# EasyEDA Pro project 最小系统板.eprj, board PCB1
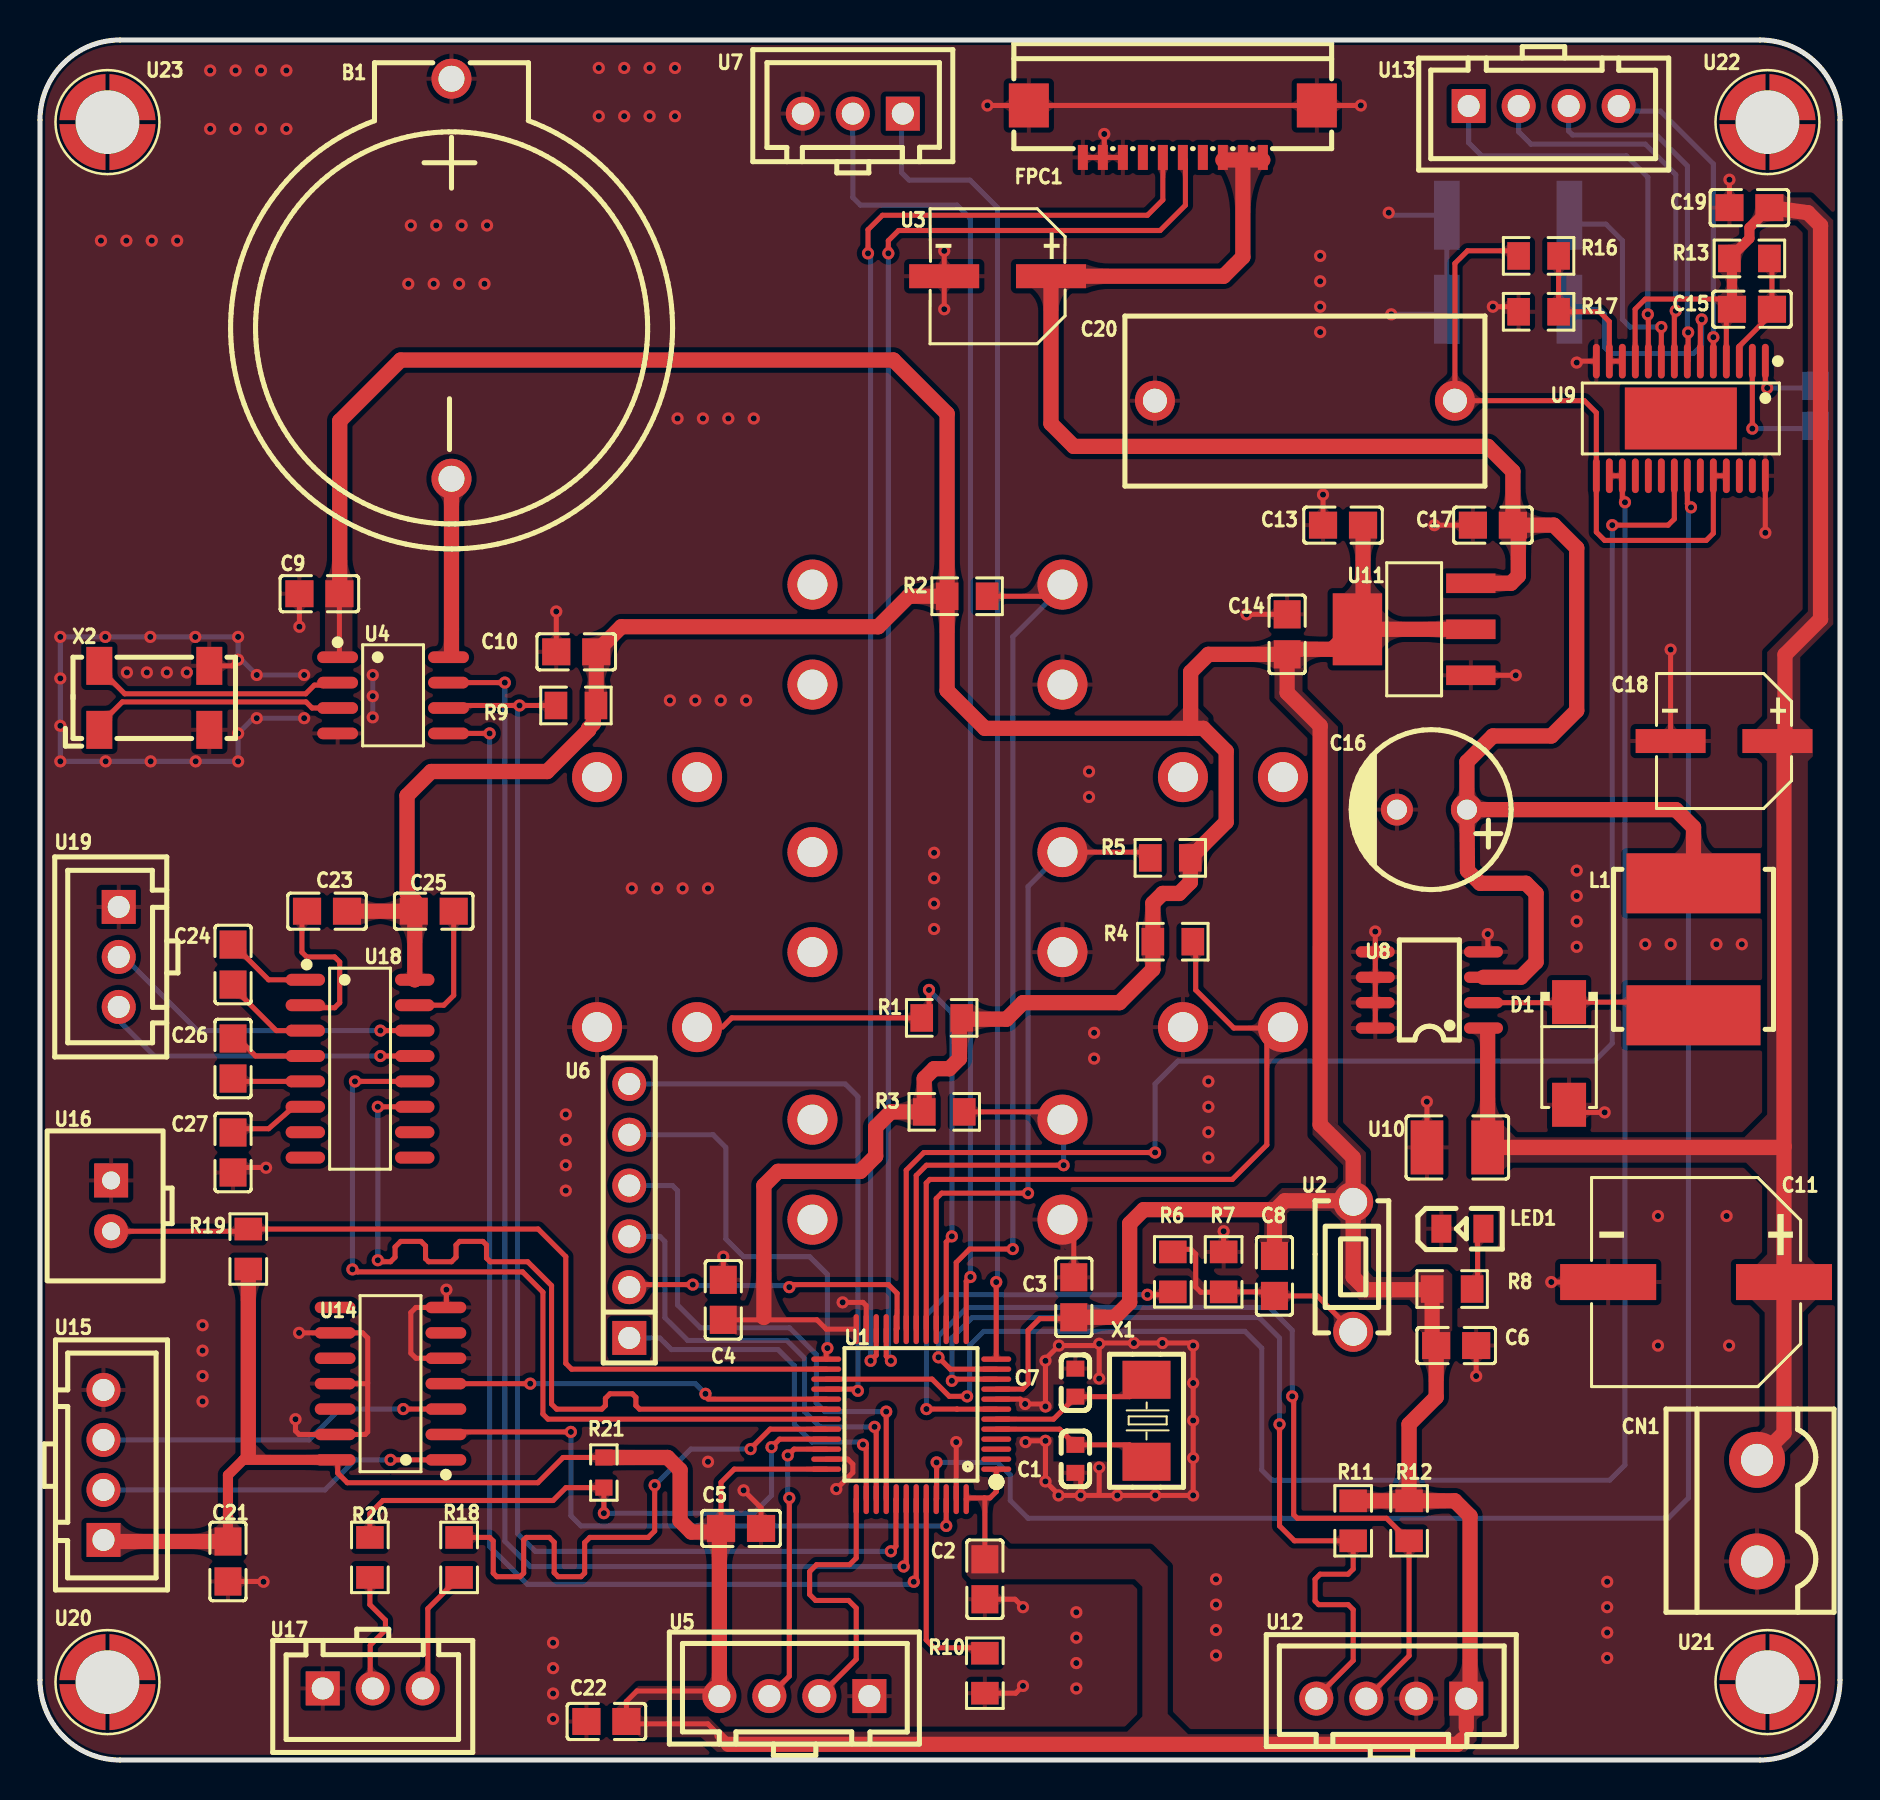
[diagram p1: board, top side]
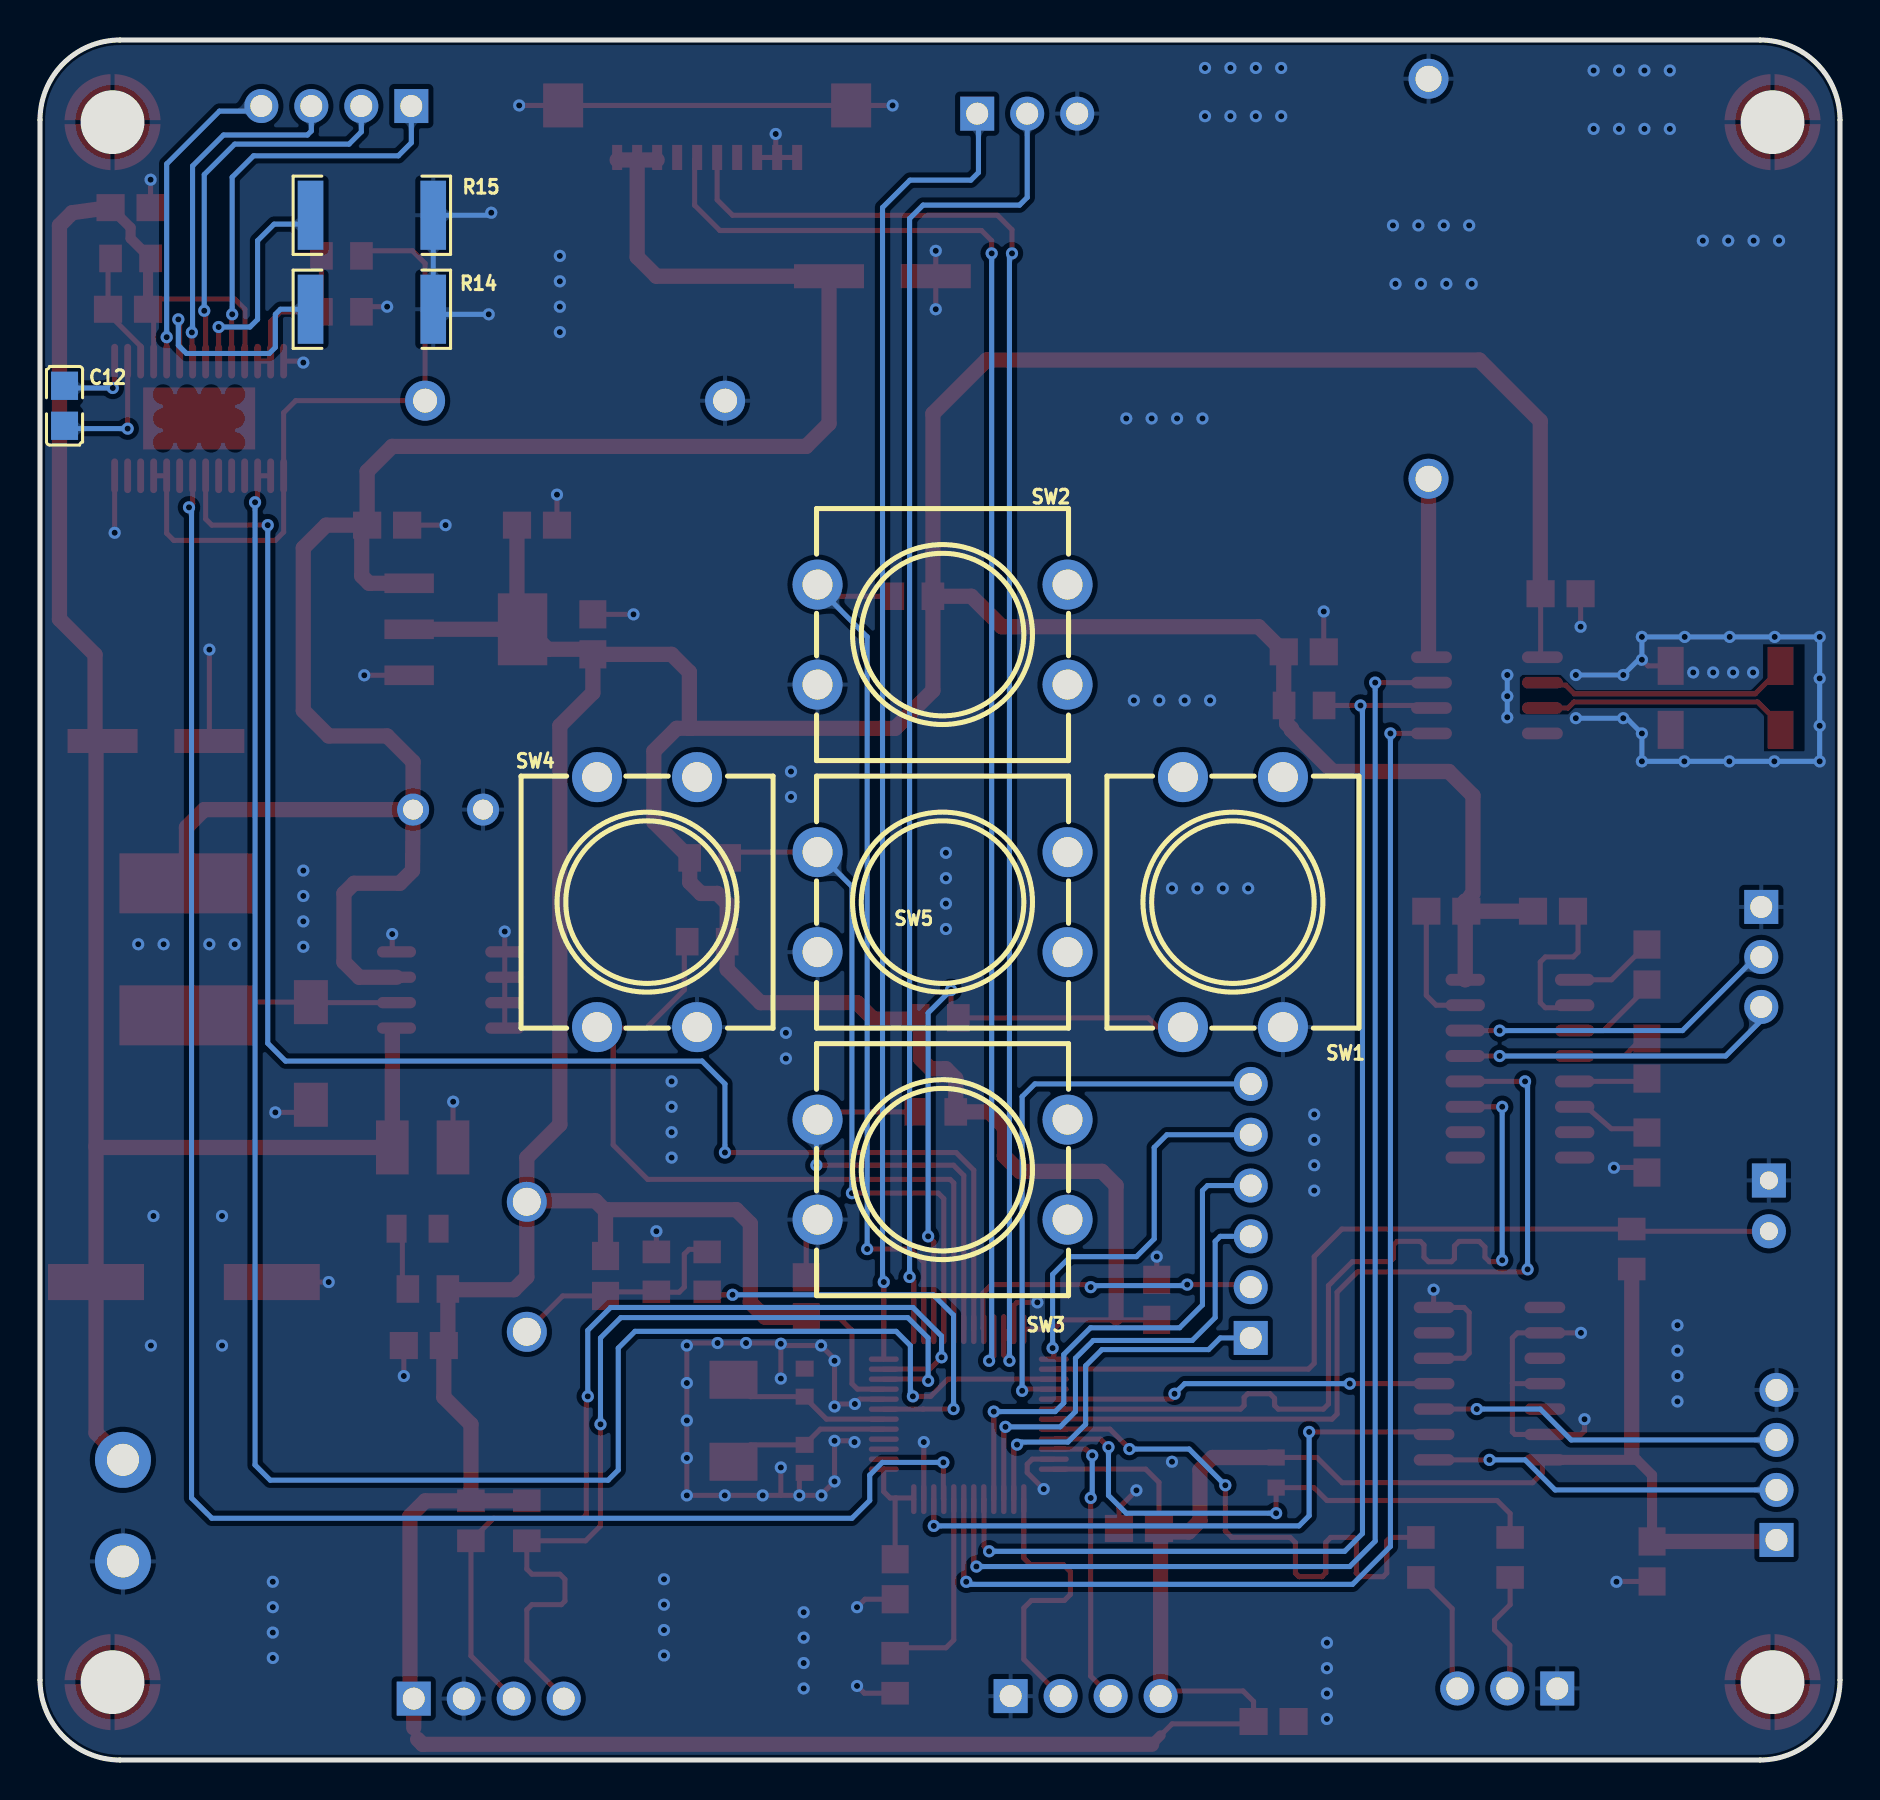
[diagram p2: board, bottom side, seen from below]

Outline 90 x 86 mm; copper layers: Top Layer, Bottom Layer. Coordinates in mm from the lower left corner of the outline.
Outline path: 0,82 0,4 arc(1.17,1.17) 4,0 86,0 arc(88.83,1.17) 90,4 90,82 arc(88.83,84.83) 86,86 4,86 arc(1.17,84.83) 0,82
Stack: Top Layer 0.035mm / Dielectric1 1.51mm FR4 er 4.5 / Bottom Layer 0.035mm

## Design rules (mm)
net OSC_IN: DP1
net OSC_OUT: DP1
net USART3_RX: DP6
net TEMP_SDA: DP10
net SCL: DP10
net USBDM: DP5
net $1N8903: DP13
net USBDP: DP5
net $1N8908: DP13
net USART2_RX: DP9
net TTL_TX: DP4
net TTL_RX: DP4
net JTMS: DP11
net JTCK: DP11
net $1N5455: DP7
net $1N5465: DP7
net 74HC_1A: DP12
net 74HC_2A: DP12
net RS232_RX: DP8
net USART3_TX: DP6
net USART2_TX: DP9
net RS232_TX: DP8
template: 自定义配置
spacing copperThickness1oz (default): track to track 0.203, other pairs 0.152 to 0.3
spacing copperThickness2oz: track to track 0.203, other pairs 0.152 to 0.3
track width copperThickness1oz (default): min 0.254, default 0.254, max 1.016
track width copperThickness2oz: min 0.203, default 0.254, max 2.54
differential pair differentialPair (default): width min 0.254, default 0.254, max 2.54; gap min 0.152, default 0.152
via viaSize (default): diameter min 0.5, default 0.61, max 10; hole min 0.305, default 0.305, max 0.305

## Placement (name value [footprint] x y rotation side)
B1  BS-2-1  [BAT-TH_BS-2-1]  20.57 74.06 180 top
C1  10pF  [C0603]  51.77 15.06 90 top
C2  100nF  [C0805]  47.24 9.04 90 top
C3  100nF  [C0805]  51.69 23.14 270 top
C4  100nF  [C0805]  34.16 23.01 270 top
C5  100nF  [C0805]  35.05 11.58 180 top
C6  100nF  [C0805]  70.81 20.72 180 top
C7  10pF  [C0603]  51.77 18.87 270 top
C8  100nF  [C0805]  61.72 24.2 270 top
C9  100nF  [C0805]  13.97 58.31 0 top
C10  100nF  [C0805]  26.81 55.41 180 top
C11  470uF  [CAP-SMD_BD10.0-L10.3-W10.3-LS11.0-R-RD]  82.8 23.9 0 top
C12  10nF  [C0805]  88.77 67.71 90 bottom
C13  10uF  [C0805]  65.15 61.74 180 top
C14  10uF  [C0805]  62.36 56.28 270 top
C15  100nF  [C0805]  85.6 72.54 180 top
C16  180uF  [CAP-TH_BD8.0-P3.50-D0.6-FD]  69.6 47.52 180 top
C17  10uF  [C0805]  72.64 61.74 180 top
C18  100uF  [CAP-SMD_BD6.3-L6.6-W6.6-LS7.6-FD-1]  84.2 50.95 180 top
C19  100nF  [C0805]  85.47 77.62 0 top
C20  470nF  [CAP-TH_L18.0-W8.5-P15.00-D0.8]  63.25 67.97 0 top
C21  100nF  [C0805]  9.4 9.93 270 top
C22  100nF  [C0805]  28.32 1.93 0 top
C23  100nF  [C0805]  14.35 42.44 0 top
C24  100nF  [C0805]  9.65 39.77 90 top
C25  100nF  [C0805]  19.69 42.44 0 top
C26  100nF  [C0805]  9.65 35.07 90 top
C27  100nF  [C0805]  9.65 30.37 90 top
CN1  KF2EDGV-5.08-2P  [CONN-TH_P5.08_KF2EDGV-5.08-2P]  85.85 12.47 270 top
D1  SS14  [SMA_L4.2-W2.6-LS5.3-RD]  76.45 35.33 270 top
FPC1  AFA01-S10FCC-00  [FPC-SMD_AFA01-S10FCC-00]  56.64 81.43 180 top
L1  68uH  [IND-SMD_L8.0-W8.0_SMNR8040]  82.68 40.53 270 top
LED1  NCD0805R1  [LED0805-R-RD]  71.12 26.56 0 top
R1  10kΩ  [R0805]  45.08 37.11 0 top
R2  10kΩ  [R0805]  46.36 58.19 180 top
R3  10kΩ  [R0805]  45.21 32.41 180 top
R4  10kΩ  [R0805]  56.64 40.92 180 top
R5  10kΩ  [R0805]  56.52 45.11 0 top
R6  1kΩ  [R0805]  56.64 24.41 90 top
R7  4.7kΩ  [R0805]  59.18 24.41 270 top
R8  1kΩ  [R0805]  70.61 23.55 180 top
R9  10kΩ  [R0805]  26.8 52.73 0 top
R10  10kΩ  [R0805]  47.24 4.34 90 top
R11  5.1kΩ  [R0805]  65.66 11.96 90 top
R12  5.1kΩ  [R0805]  68.45 11.96 90 top
R13  1MΩ  [R0805]  85.47 75.08 0 top
R14  200mΩ  [R2512]  73.41 72.54 0 bottom
R15  200mΩ  [R2512]  73.41 77.24 0 bottom
R16  20kΩ  [R0805]  74.93 75.21 0 top
R17  1kΩ  [R0805]  74.93 72.41 180 top
R18  22Ω  [R0805]  20.95 10.13 90 top
R19  10kΩ  [R0805]  10.41 25.55 270 top
R20  22Ω  [R0805]  16.49 10.13 90 top
R21  1.5kΩ  [R0603]  28.19 14.37 90 top
SW1  12x12x7.3 黄头  [SW-TH_4P-L12.0-W12.0-P5.00-LS12.5]  30.35 42.89 90 bottom
SW2  12x12x7.3 黄头  [SW-TH_4P-L12.0-W12.0-P5.00-LS12.5]  44.87 56.27 180 bottom
SW3  12x12x7.3 黄头  [SW-TH_4P-L12.0-W12.0-P5.00-LS12.5]  44.87 29.52 180 bottom
SW4  12x12x7.3 黄头  [SW-TH_4P-L12.0-W12.0-P5.00-LS12.5]  59.65 42.89 90 bottom
SW5  12x12x7.3 黄头  [SW-TH_4P-L12.0-W12.0-P5.00-LS12.5]  44.87 42.89 180 bottom
U1  STM32F103C8T6  [LQFP-48_L7.0-W7.0-P0.50-LS9.0-BL]  43.56 17.29 90 top
U2  ZX-QC36-4.3CJ  [KEY-TH_L6.0-W3.5-P6.50]  65.66 24.66 90 top
U3  180uF  [CAP-SMD_BD6.3-L6.6-W6.6-LS7.3-FD]  47.88 74.19 180 top
U4  DS1302Z+T&R  [SOIC-8_L4.9-W3.9-P1.27-LS6.0-BL]  17.65 53.23 270 top
U5  2.54-4P ZZDK  [HDR-TH_4P-P2.50-V-F-2]  37.72 3.2 180 top
U6  HB-PH3-25416PB2GOP  [HDR-TH_6P-P2.54-V-M]  29.46 27.45 90 top
U7  2.54-3P ZZDK  [HDR-TH_3P-P2.50-V-F-2]  40.64 82.32 180 top
U8  XL1509-ADJE1  [SOIC-8_L5.0-W4.0-P1.27-LS6.0-BL]  69.47 38.5 90 top
U9  DRV8825PWPR  [HTSSOP-28_L9.7-W4.4-P0.65-LS6.4-BL-EP]  82.04 67.08 180 top
U10  1uF  [C1210]  70.87 30.63 0 top
U11  AMS1117-3.3  [SOT-223-4_L6.5-W3.5-P2.30-LS7.0-BR]  68.71 56.54 0 top
U12  2.54-4P ZZDK  [HDR-TH_4P-P2.50-V-F-2]  67.56 3.07 180 top
U13  2.54-4P ZZDK  [HDR-TH_4P-P2.50-V-F-2]  75.18 82.7 0 top
U14  SN74HC14DR  [SOIC-14_L8.7-W3.9-P1.27-LS6.0-BL]  17.53 18.82 90 top
U15  2.54-4P ZZDK  [HDR-TH_4P-P2.50-V-F-2]  3.18 14.75 90 top
U16  2.54-2P ZZDK  [HDR-TH_2P-P2.50-V-F-1]  3.56 27.71 270 top
U17  2.54-3P ZZDK  [HDR-TH_3P-P2.50-V-F-2]  16.64 3.58 0 top
U18  MAX3232ESE+T  [SOIC-16_L9.9-W3.9-P1.27-LS6.0-BL]  16 34.57 270 top
U19  2.54-3P ZZDK  [HDR-TH_3P-P2.50-V-F-2]  3.94 40.15 270 top
U20  M3x10+6Cu  [SMD_L4.7-W4.7-D3.0]  3.37 3.89 0 top
U21  M3x10+6Cu  [SMD_L4.7-W4.7-D3.0]  86.37 3.89 0 top
U22  M3x10+6Cu  [SMD_L4.7-W4.7-D3.0]  86.37 81.89 0 top
U23  M3x10+6Cu  [SMD_L4.7-W4.7-D3.0]  3.37 81.89 0 top
X1  12MHz  [OSC-SMD_L5.0-W3.2]  55.33 16.96 90 top
X2  32.768kHz  [CRYSTAL-SMD_4P-L8.0-W3.8-BL]  5.72 53.11 0 top

## Footprints (pads in the part's own frame, mm; a bottom-side part is the same pattern mirrored in y, then rotated)
BAT-TH_BS-2-1
  round 2 hole 1.3: 1(0,-10) 2(0,10)
C0603
  rect 0.8x0.9 smd: 1(-0.7,0) 2(0.7,0)
C0805
  rect 1.41x1.35 smd: 1(-1,0) 2(1,0)
C1210
  rect 1.635x2.7 smd: 1(-1.518,0) 2(1.518,0)
CAP-SMD_BD6.3-L6.6-W6.6-LS7.3-FD
  rect 3.5x1.2 smd: 1(-2.67,0) 2(2.67,0)
CAP-SMD_BD6.3-L6.6-W6.6-LS7.6-FD-1
  rect 3.5x1.2 smd: 1(-2.67,0) 2(2.67,0)
CAP-SMD_BD10.0-L10.3-W10.3-LS11.0-R-RD
  rect 4.8x1.8 smd: 1(4.395,0) 2(-4.395,0)
CAP-TH_BD8.0-P3.50-D0.6-FD
  round 1.6 hole 1: 1(-1.75,0) 2(1.75,0)
CAP-TH_L18.0-W8.5-P15.00-D0.8
  round 2 hole 1.2: 1(-7.5,0) 2(7.5,0)
CONN-TH_P5.08_KF2EDGV-5.08-2P
  round 2.8 hole 1.6: 1(-2.54,0) 2(2.54,0)
CRYSTAL-SMD_4P-L8.0-W3.8-BL
  rect 1.3x1.9 smd: 1(-2.75,-1.6) 2(2.75,-1.6) 3(2.75,1.6) 4(-2.75,1.6)
FPC-SMD_AFA01-S10FCC-00
  rect 0.5x1.25 smd: 1(-4.5,1.3) 2(-3.5,1.3) 3(-2.501,1.3) 4(-1.5,1.3) 5(-0.5,1.3) 6(0.499,1.3) 7(1.5,1.3) 8(2.499,1.3) 9(3.5,1.3) 10(4.5,1.3)
  rect 2x2.2 smd: 11(-7.2,-1.3) 12(7.2,-1.3)
HDR-TH_2P-P2.50-V-F-1
  rect 1.7x1.7 hole 0.9: 1(-1.27,0)
  round 1.7 hole 0.9: 2(1.27,0)
HDR-TH_3P-P2.50-V-F-2
  rect 1.7x1.7 hole 1.1: 1(-2.5,0)
  round 1.7 hole 1.1: 2(0,0) 3(2.5,0)
HDR-TH_4P-P2.50-V-F-2
  rect 1.7x1.7 hole 1.1: 1(-3.75,0)
  round 1.7 hole 1.1: 2(-1.25,0) 3(1.25,0) 4(3.75,0)
HDR-TH_6P-P2.54-V-M
  rect 1.7x1.7 hole 1.1: 1(-6.35,0)
  round 1.7 hole 1.1: 2(-3.81,0) 3(-1.27,0) 4(1.27,0) 5(3.81,0) 6(6.35,0)
HTSSOP-28_L9.7-W4.4-P0.65-LS6.4-BL-EP
  oval 0.343x1.732 smd: 1(-4.225,-2.866) 2(-3.575,-2.866) 3(-2.925,-2.866) 4(-2.275,-2.866) 5(-1.625,-2.866) 6(-0.975,-2.866) 7(-0.325,-2.866) 8(0.325,-2.866) 9(0.975,-2.866) 10(1.625,-2.866) 11(2.275,-2.866) 12(2.925,-2.866) 13(3.575,-2.866) 14(4.225,-2.866) 15(4.225,2.866) 16(3.575,2.866) 17(2.925,2.866) 18(2.275,2.866) 19(1.625,2.866) 20(0.975,2.866) 21(0.325,2.866) 22(-0.325,2.866) 23(-0.975,2.866) 24(-1.625,2.866) 25(-2.275,2.866) 26(-2.925,2.866) 27(-3.575,2.866) 28(-4.225,2.866)
  rect 5.6x3.1 smd: 29(0,0)
IND-SMD_L8.0-W8.0_SMNR8040
  rect 3x6.7 smd: 1(-3.3,0) 2(3.3,0)
KEY-TH_L6.0-W3.5-P6.50
  round 2 hole 1.4: 1(-3.25,0) 2(3.25,0)
LED0805-R-RD
  rect 1x1.399 smd: 1(1.05,0) 2(-1.05,0)
LQFP-48_L7.0-W7.0-P0.50-LS9.0-BL
  oval 0.27x1.5 smd: 1(-2.75,-4.25) 2(-2.25,-4.25) 3(-1.75,-4.25) 4(-1.25,-4.25) 5(-0.75,-4.25) 6(-0.25,-4.25) 7(0.25,-4.25) 8(0.75,-4.25) 9(1.25,-4.25) 10(1.75,-4.25) 11(2.25,-4.25) 12(2.75,-4.25) 25(2.75,4.25) 26(2.25,4.25) 27(1.75,4.25) 28(1.25,4.25) 29(0.75,4.25) 30(0.25,4.25) 31(-0.25,4.25) 32(-0.75,4.25) 33(-1.25,4.25) 34(-1.75,4.25) 35(-2.25,4.25) 36(-2.75,4.25)
  oval 1.5x0.27 smd: 13(4.25,-2.75) 14(4.25,-2.25) 15(4.25,-1.75) 16(4.25,-1.25) 17(4.25,-0.75) 18(4.25,-0.25) 19(4.25,0.25) 20(4.25,0.75) 21(4.25,1.25) 22(4.25,1.75) 23(4.25,2.25) 24(4.25,2.75) 37(-4.25,2.75) 38(-4.25,2.25) 39(-4.25,1.75) 40(-4.25,1.25) 41(-4.25,0.75) 42(-4.25,0.25) 43(-4.25,-0.25) 44(-4.25,-0.75) 45(-4.25,-1.25) 46(-4.25,-1.75) 47(-4.25,-2.25) 48(-4.25,-2.75)
OSC-SMD_L5.0-W3.2
  rect 1.9x2.4 smd: 1(-2.05,0) 2(2.05,0)
R0603
  rect 0.806x0.864 smd: 1(-0.753,0) 2(0.753,0)
R0805
  rect 1.133x1.377 smd: 1(-1,0) 2(1,0)
R2512
  rect 1.282x3.456 smd: 1(-3.067,0) 2(3.067,0)
SMA_L4.2-W2.6-LS5.3-RD
  rect 2.2x1.7 smd: 1(-2.566,0) 2(2.566,0)
SMD_L4.7-W4.7-D3.0
  custom 2.3x2.3 smd: 1(-1.25,-1.528) 1(-1.25,1.528) 1(1.25,1.528) 1(1.25,-1.528)
SOIC-8_L4.9-W3.9-P1.27-LS6.0-BL
  oval 0.588x2.045 smd: 1(-1.905,-2.772) 2(-0.635,-2.772) 3(0.635,-2.772) 4(1.905,-2.772) 5(1.905,2.772) 6(0.635,2.772) 7(-0.635,2.772) 8(-1.905,2.772)
SOIC-8_L5.0-W4.0-P1.27-LS6.0-BL
  oval 0.569x1.95 smd: 1(-1.905,-2.705) 2(-0.635,-2.705) 3(0.635,-2.705) 4(1.905,-2.705) 5(1.905,2.705) 6(0.635,2.705) 7(-0.635,2.705) 8(-1.905,2.705)
SOIC-14_L8.7-W3.9-P1.27-LS6.0-BL
  oval 0.574x2.038 smd: 1(-3.81,-2.769) 2(-2.54,-2.769) 3(-1.27,-2.769) 4(0,-2.769) 5(1.27,-2.769) 6(2.54,-2.769) 7(3.81,-2.769) 8(3.81,2.769) 9(2.54,2.769) 10(1.27,2.769) 11(0,2.769) 12(-1.27,2.769) 13(-2.54,2.769) 14(-3.81,2.769)
SOIC-16_L9.9-W3.9-P1.27-LS6.0-BL
  oval 0.602x1.971 smd: 1(-4.445,-2.736) 2(-3.175,-2.736) 3(-1.905,-2.736) 4(-0.635,-2.736) 5(0.635,-2.736) 6(1.905,-2.736) 7(3.175,-2.736) 8(4.445,-2.736) 9(4.445,2.736) 10(3.175,2.736) 11(1.905,2.736) 12(0.635,2.736) 13(-0.635,2.736) 14(-1.905,2.736) 15(-3.175,2.736) 16(-4.445,2.736)
SOT-223-4_L6.5-W3.5-P2.30-LS7.0-BR
  rect 2.47x0.98 smd: 1(2.835,-2.3) 2(2.835,0) 3(2.835,2.3)
  rect 2.47x3.6 smd: 4(-2.835,0)
SW-TH_4P-L12.0-W12.0-P5.00-LS12.5
  round 2.5 hole 1.5: 1(-6.25,2.5) 2(6.25,2.5) 3(-6.25,-2.5) 4(6.25,-2.5)

## Nets
As in the schematic.

Pads without a net: FPC1 4 7; SW1 2 4; SW2 2 4; SW3 2 4; SW4 2 4; SW5 2 4; U1 2 3 4; U9 18 19 20 23 26 27 29; U14 6 8 10 12; U18 7 8 9 10; U20 1; U21 1; U22 1; U23 1

## Via types
v1: diameter 0.61, hole 0.305, Top Layer to Bottom Layer, 238 vias

## Routing (per net, layer and track width the routed paths; a pad name or vN(x,y) marks a point on that pad's centre or on a via; arc(x,y) is an arc through that point)
3.3V: length 405.9
  Top Layer w0.254: 47.22,13.1 47.24,13.07 C2.2 ; 47.22,13.1 47.5,13.1 47.82,13.42 47.82,14.54 U1.1 ; 47.22,13.1 46.37,13.1 U1.48 ; U14.14 14.88,14.88 14.88,14.35 15.37,13.86 24.89,13.86 26.15,15.13 R21.2 ; U5.4 33.72,3.45 29.85,3.45 29.32,2.93 C22.2 29.44,1.81 33.39,1.81 33.97,1.23 ; U1.36 34.72,14.54 34.05,13.88 C5.2 ; 18.43,42.44 18.48,42.49 18.48,43.21 18.74,42.95 ; C4.2 38.85,22.01 39.31,21.54 U1.24 ; U4.1 14.97,55.23 C9.2 ; C3.2 51.62,22.07 49.99,22.07 49.4,21.48 49.4,18.82 49.13,18.54 U1.9
  Top Layer w0.508: U14.14 10.16,15.01 9.4,14.25 C21.1 ; 33.97,1.23 34.42,0.78
  Top Layer w0.762: 18.48,43.21 18.35,43.34 18.35,48.22 19.56,49.42 25.36,49.42 27.43,51.5 27.43,51.58 27.67,51.82 27.67,52.6 R9.2 27.81,52.74 C10.1 29.07,56.66 41.91,56.66 43.43,58.19 R2.2 ; C21.1 3.25,10.93 U15.1 ; 36.2,22.12 36.2,28.72 36.9,29.43 41.02,29.43 41.78,30.19 41.78,31.64 42.55,32.41 R3.2 44.21,34.07 44.7,34.57 45.47,34.57 45.97,35.07 45.97,36.87 46.08,36.98 R1.2 ; 57.52,51.58 57.52,51.82 57.53,51.84 57.53,54.39 58.42,55.28 C14.2 ; 57.52,51.58 47.24,51.58 45.36,53.47 R2.2 ; 57.52,51.58 58.17,51.58 59.31,50.44 59.31,46.9 R5.2 57.52,43.89 56.96,43.33 56.13,43.33 55.64,42.84 R4.2 55.64,39.53 53.98,37.87 49.15,37.87 48.32,37.04 46.28,37.04 46.15,37.16 ; C8.1 61.72,27.45 ; 61.72,27.45 62.23,27.96 65.41,27.96 ; 61.72,27.45 61.66,27.52 55.18,27.52 54.48,26.82 54.48,22.88 53.74,22.14 C3.2 ; R2.2 45.36,67.32 42.67,70 18.03,70 14.99,66.95 14.99,58.33 C9.2 ; 71.31,2.81 71.31,1.61 ; R12.2 70.74,12.96 71.5,12.2 71.5,3.51 71.63,3.38 ; R12.2 68.45,16.78 69.81,18.14 C6.2 69.61,20.92 R8.2 69.57,23.52 66.29,23.52 65.66,24.15 U2.2 ; R12.2 R11.2 ; 65.66,28.47 65.66,30.12 64.01,31.77 64.01,51.71 62.36,53.36 C14.2 ; U5.4 33.97,11.5 ; C13.1 66.15,56.82 U11.4 ; 34.42,0.78 70.87,0.78 71.12,1.04 ; 33.75,11.4 32.56,11.4 32,11.96 32,14.5 31.38,15.13 R21.2 ; C14.2 62.61,55.54 64.62,55.54 65.62,56.54 U11.4 ; U11.4 U11.2 ; R19.2 10.41,15.26 ; U18.16 18.74,39.01 18.74,42.95 18.74,42.95 ; 18.43,42.44 C23.2
5V: length 104.7
  Top Layer w0.762: L1.1 82.68,46.63 81.79,47.52 C16.1 ; C17.1 73.91,61.47 73.91,59.2 73.55,58.84 U11.3 ; C17.1 75.69,61.74 76.83,60.6 76.83,52.47 75.57,51.2 72.64,51.2 71.35,49.9 C16.1 ; C17.1 73.64,64.43 72.39,65.68 51.69,65.68 50.55,66.82 U3.1 59.18,74.19 60.14,75.15 60.14,80 ; 59.14,80 60.14,80 ; 60.14,80 61.14,80 ; 72.17,39.14 74.04,39.14 74.8,39.9 74.8,43.33 74.3,43.84 72.01,43.84 71.37,44.47 C16.1
12V: length 101.9
  Top Layer w0.254: U9.4 84.32,72.51 ; 84.09,73.05 80.26,73.05 79.76,72.54 79.76,70.44
  Top Layer w0.508: C15.2 84.6,74.95 R13.1 85.47,76.08 85.47,76.62 C19.2
  Top Layer w0.762: C19.2 86.55,77.62 88.39,77.36 89.03,76.73 89.03,57.04 87.25,55.27 87.25,51.33 C18.1 87.2,50.62 87.2,30.67 ; CN1.1 87.2,16.35 C11.1 87.2,30.67 ; 72.38,36.39 U10.2 87.15,30.63 87.2,30.67
GND: length 189.6
  Top Layer w0.254: v1(39.81,13.55) 40.64,14.37 40.64,14.79 40.39,15.04 U1.35 ; C21.2 11.16,8.93 v1(11.18,8.91) ; C11.2 v1(75.57,23.9) ; U11.1 v1(73.79,54.24) ; v1(76.83,69.87) 76.91,69.94 U9.14 ; v1(72.39,41.3) 72.39,40.62 72.17,40.41 ; C18.2 v1(81.53,55.52) ; C2.1 48.75,8.04 v1(49.15,7.64) ; v1(52.03,13.23) 52.03,14.09 C1.1 ; v1(52.03,13.23) v1(53.86,13.23) v1(55.76,13.23) v1(57.66,13.23) v1(57.66,15.1) v1(57.66,16.98) v1(57.66,18.85) v1(57.66,20.72) 57.53,20.85 v1(56.12,20.85) v1(54.7,20.85) 53.09,20.85 52.96,20.72 ; v1(52.03,13.23) 50.97,13.23 v1(50.27,13.93) v1(50.27,15.96) 49.34,15.96 v1(49.28,15.9) ; v1(45.21,72.54) 45.21,74.19 U3.2 45.21,74.19 v1(45.21,75.46) ; C10.2 v1(25.81,57.43) ; 52.96,20.72 v1(52.96,19.07) ; 52.96,20.72 v1(52.96,20.81) ; 52.96,20.72 v1(50.95,20.72) 50.27,20.05 v1(50.27,17.67) 50.15,17.8 v1(49.26,17.8) 49.02,18.04 U1.8 ; C13.2 v1(64.15,63.27) ; 16.38,18.85 16.38,21.1 16.13,21.36 U14.9 v1(12.95,21.36) ; 16.38,18.85 16.35,18.82 U14.11 ; 16.38,18.85 16.38,16.4 16.26,16.28 U14.13 12.95,16.28 12.77,16.46 v1(12.77,17.04) ; C5.1 36.05,12.61 v1(35.18,13.48) ; U9.28 v1(86.27,61.36) ; C6.1 v1(71.81,19.2) ; v1(72.64,72.67) 73.68,72.67 R17.2 ; C3.1 51.69,26.58 51.12,27.14 ; v1(47.37,82.73) FPC1.11 v1(66.04,82.73) ; v1(20.32,23.52) 20.32,22.65 U14.7 18.8,22.63 18.54,22.37 18.54,20.34 18.8,20.09 U14.5 ; C19.1 v1(84.47,79.02) ; v1(9.91,55.01) 9.6,54.71 X2.3 ; 76.33,32.38 v1(78.23,32.38) ; C17.2 v1(69.72,61.74) ; v1(11.3,29.61) 11.29,29.63 9.53,29.63 ; R7.1 v1(59.18,26.44) ; v1(53.21,81.3) 53.21,80.2 FPC1.9 ; U1.23 41.31,22.72 41.15,22.88 v1(40.13,22.88) ; C9.1 v1(12.97,56.66) ; FPC1.9 FPC1.8 ; FPC1.9 FPC1.10 ; 52.96,13.27 v1(52.96,14.63) ; U8.8 U8.7 U8.6 U8.5 v1(66.76,41.42) ; C4.1 v1(34.16,25.17) ; U1.47 v1(45.81,15.9) ; R10.1 48.78,3.34 v1(49.15,3.7) ; v1(69.34,32.91) 69.35,32.91 U10.1 ; C14.1 v1(60.33,57.28)
  Bottom Layer w0.254: v1(16.64,54.25) v1(16.64,53.19) v1(16.64,52.13) ; v1(13.21,52.09) v1(10.84,52.09) 10.67,52.09 v1(9.91,51.33) v1(9.91,49.93) v1(7.78,49.93) v1(5.53,49.93) v1(3.28,49.93) v1(1.02,49.93) v1(1.02,51.71) v1(1.02,54.08) v1(1.02,56.16) v1(3.27,56.16) v1(5.52,56.16) v1(7.77,56.16) v1(9.91,56.16) v1(9.91,55.01) 10.08,55.01 v1(10.84,54.25) v1(13.21,54.25) ; v1(67.44,77.36) 67.56,77.24 R15.1 R14.1 70.09,72.28 v1(67.56,72.28)
  vias: v1(3.05,75.97) v1(4.32,75.97) v1(4.34,54.38) v1(5.34,54.38) v1(5.59,75.97) v1(6.34,54.38) v1(6.86,75.97) v1(7.34,54.38) v1(8.13,21.74) v1(8.13,20.47) v1(8.13,19.2) v1(8.13,17.93) v1(8.51,84.48) v1(8.51,81.56) v1(9.78,84.48) v1(9.78,81.56) v1(11.05,84.48) v1(11.05,81.56) v1(12.32,84.48) v1(12.32,81.56) v1(18.42,73.81) v1(18.54,76.73) v1(19.69,73.81) v1(19.81,76.73) v1(20.95,73.81) v1(21.08,76.73) v1(22.23,73.81) v1(22.35,76.73) v1(25.65,5.86) v1(25.65,4.59) v1(25.65,3.32) v1(25.65,2.05) v1(26.29,32.28) v1(26.29,31.01) v1(26.29,29.74) v1(26.29,28.47) v1(27.94,84.6) v1(27.94,82.19) v1(29.21,84.6) v1(29.21,82.19) v1(29.59,43.58) v1(30.48,84.6) v1(30.48,82.19) v1(30.86,43.58) v1(31.5,52.98) v1(31.75,84.6) v1(31.75,82.19) v1(31.88,67.08) v1(32.13,43.58) v1(32.77,52.98) v1(33.15,67.08) v1(33.4,43.58) v1(33.4,14.91) v1(34.04,52.98) v1(34.42,67.08) v1(35.31,52.98) v1(35.69,67.08) v1(44.7,45.36) v1(44.7,44.09) v1(44.7,42.82) v1(44.7,41.55) v1(50.27,19.96) v1(50.93,13.23) v1(51.82,7.39) v1(51.82,6.12) v1(51.82,4.85) v1(51.82,3.58) v1(52.45,49.42) v1(52.45,48.15) v1(52.7,36.36) v1(52.7,35.07) v1(58.42,33.93) v1(58.42,32.66) v1(58.42,31.39) v1(58.42,30.12) v1(58.8,9.04) v1(58.8,7.77) v1(58.8,6.5) v1(58.8,5.23) v1(64.01,75.21) v1(64.01,73.94) v1(64.01,72.67) v1(64.01,71.4) v1(76.83,44.47) v1(76.83,43.2) v1(76.83,41.93) v1(76.83,40.66) v1(78.36,8.91) v1(78.36,7.64) v1(78.36,6.37) v1(78.36,5.1) v1(80.26,40.79) v1(80.9,27.2) v1(80.9,20.72) v1(81.53,40.79) v1(83.82,40.79) v1(84.33,27.2) v1(84.45,20.72) v1(85.09,40.79)
V3P3OUT: length 33.5
  Top Layer w0.254: R16.1 73.93,75.33 73.8,75.46 71.37,75.46 70.75,74.83 C20.2 77.22,67.97 77.82,67.37 U9.15 77.82,61.4 78.23,60.98 83.31,60.98 83.67,61.34 U9.24 U9.25
74HC_1A: length 17.7
  Top Layer w0.254: U14.1 v1(17.53,15.01)
  Bottom Layer w0.254: v1(17.53,15.01) 15.75,15.01 14.24,13.5 U15.2
74HC_1Y: length 30.8
  Top Layer w0.254: U1.46 v1(45.31,11.71) ; U14.2 20.42,16.4 v1(26.54,16.4)
  Bottom Layer w0.254: v1(26.54,16.4) 26.54,12.21 27.05,11.71 v1(45.31,11.71)
74HC_2A: length 17.8
  Top Layer w0.254: U14.3 v1(18.16,17.55)
  Bottom Layer w0.254: v1(18.16,17.55) 14.99,17.55 13.44,16 U15.3
74HC_2Y: length 19.1
  Top Layer w0.254: U1.29 33.4,18.04 ; U14.4 v1(24.51,18.82)
  Bottom Layer w0.254: v1(24.51,18.82) 32.77,18.82 v1(33.27,18.31)
AOUT1: length 15.8
  Top Layer w0.254: U9.5 v1(83.67,71.14)
  Bottom Layer w0.254: U13.4 79.19,82.44 81.03,82.44 83.67,79.8 v1(83.67,71.14)
AOUT2: length 17.7
  Top Layer w0.254: v1(82.41,71.38) 82.41,69.98 U9.7
  Bottom Layer w0.254: v1(82.41,71.38) 82.37,71.42 82.37,79.7 80.82,81.25 76.63,81.25 76.43,81.45 U13.3
BATA+: length 8.8
  Top Layer w0.762: B1.2 20.57,55.29
BOOT0: length 10.2
  Top Layer w0.254: U1.44 44.31,6 44.7,5.61 46.97,5.61 R10.2
BOUT1: length 20.7
  Top Layer w0.254: U9.10 80.42,72.26 v1(80.39,72.28)
  Bottom Layer w0.254: v1(80.39,72.28) 80.39,79.14 79.32,80.21 72.08,80.21 71.43,80.86 U13.1
BOUT2: length 19.4
  Top Layer w0.254: v1(81.79,72.46) 81.72,72.39 U9.8
  Bottom Layer w0.254: U13.2 73.93,81.41 74.55,80.79 80.26,80.79 81.79,79.27 v1(81.79,72.46)
D_KU: length 22.7
  Top Layer w0.254: v1(51.18,29.74) 44.32,29.74 43.81,29.23 U1.18 ; 51.12,32.14 50.86,32.41 R3.1
  Bottom Layer w0.254: v1(51.18,29.74) 51.18,32.09 51.12,32.14
ENA: length 79.2
  Top Layer w0.254: v1(55.75,30.37) 44.2,30.37 43.31,29.49 U1.19 ; v1(78.61,61.74) 81.41,61.74 81.72,62.05 U9.21
  Bottom Layer w0.254: v1(55.75,30.37) 55.75,33.8 56.9,34.95 77.72,34.95 78.61,35.84 v1(78.61,61.74)
FN_CP: length 33.5
  Top Layer w0.254: v1(49.4,28.34) 45.08,28.34 44.81,28.07 U1.16 ; R5.1 55.23,45.39 SW5.1
  Bottom Layer w0.254: SW5.1 49.4,43.67 v1(49.4,28.34)
JTCK: length 14.5
  Top Layer w0.254: U5.2 40.81,5.04 40.81,7.6 40.43,7.98 38.78,7.98 38.48,8.28 38.48,9.42 38.83,9.77 40.48,9.77 40.81,10.1 U1.37
JTMS: length 14.5
  Top Layer w0.254: U1.34 37.7,15.54 v1(37.39,15.23) ; v1(37.47,13.1) 37.47,4.19 U5.3
  Bottom Layer w0.254: v1(37.47,13.1) 37.39,13.18 v1(37.39,15.23)
KEY_RESET: length 21
  Top Layer w0.254: R6.1 56.5,23.26 v1(55.37,23.26) ; U1.7 45.85,17.54 45.84,17.55 v1(44.32,17.55)
  Bottom Layer w0.254: v1(44.32,17.55) 44.32,22.25 45.34,23.26 v1(55.37,23.26)
L_SGSAVE: length 29.3
  Top Layer w0.254: 34.12,36.64 34.58,37.11 R1.1 44.45,37.47 v1(44.45,38.5) ; v1(45.59,26.18) 45.31,25.9 U1.15
  Bottom Layer w0.254: v1(44.45,38.5) 45.59,37.36 v1(45.59,26.18)
MOTRST: length 100.2
  Top Layer w0.254: v1(79.25,62.89) 79.12,63.02 U9.17 U9.16 ; U1.27 44.61,19.04 45.47,18.18 v1(46.36,18.18)
  Bottom Layer w0.254: v1(46.36,18.18) 46.48,18.31 46.48,20.72 47.19,21.43 60.25,21.43 61.09,20.59 61.09,14.5 61.6,13.99 78.49,13.99 79.25,14.75 v1(79.25,62.89)
OSC_IN: length 8.2
  Top Layer w0.254: X1.1 54.48,15.76 C1.2 50.98,16.54 U1.5
OSC_OUT: length 8.3
  Top Layer w0.254: X1.2 54.48,18.17 51.77,18.17 51.77,18.14 50.68,17.04 U1.6
PA15: length 17.5
  Top Layer w0.254: v1(41.15,15.77) 41.31,15.61 U1.38
  Bottom Layer w0.254: 30.35,21.1 30.99,21.1 31.57,20.52 36.91,20.52 37.72,19.71 37.72,16.78 38.61,15.9 41.02,15.9 v1(41.15,15.77)
PB2: length 15.5
  Top Layer w0.254: U1.20 42.85,21.59 42.85,23.33 42.42,23.77 37.59,23.77 v1(37.47,23.64) ; v1(32.64,23.77) 29.59,23.77 U6.2
  Bottom Layer w0.254: v1(37.47,23.64) 37.39,23.72 32.69,23.72 v1(32.64,23.77)
PB3: length 22.8
  Top Layer w0.254: U1.39 41.81,16.57 v1(41.73,16.66)
  Bottom Layer w0.254: 30.35,26.18 30.99,26.18 31.24,25.93 31.24,22.12 32.39,20.98 37.34,20.98 38.23,20.09 38.23,17.42 38.99,16.66 v1(41.73,16.66)
PB4: length 25.8
  Top Layer w0.254: U1.40 v1(42.31,17.42)
  Bottom Layer w0.254: 30.35,28.72 31.62,28.72 31.88,28.47 31.88,22.75 33.02,21.61 37.48,21.61 38.81,20.28 38.81,17.85 39.24,17.42 v1(42.31,17.42)
PB12: length 18.8
  Top Layer w0.254: v1(39.37,20.59) 39.31,20.54 U1.25
  Bottom Layer w0.254: v1(39.37,20.59) 39.37,24.28 38.48,25.17 35.18,25.17 34.29,26.06 34.29,30.63 33.66,31.26 30.35,31.26
PB15: length 27.1
  Top Layer w0.254: U1.28 40.81,18.54 v1(40.89,18.46)
  Bottom Layer w0.254: v1(40.89,18.46) 40.89,33.17 40.26,33.8 30.35,33.8
R_G: length 37.6
  Top Layer w0.254: R4.1 57.79,40.77 57.79,38.5 59.69,36.6 61.09,36.6 61.34,36.34 61.34,30.76 59.62,29.03 44.49,29.03 44.31,28.85 U1.17
RS232_RX: length 16.2
  Top Layer w0.254: U18.13 v1(17.02,35.2)
  Bottom Layer w0.254: v1(17.02,35.2) 5.72,35.2 3.94,36.98 U19.3
RS232_TX: length 16.3
  Top Layer w0.254: U18.14 v1(17.02,36.47)
  Bottom Layer w0.254: U19.2 4.19,40.15 7.87,36.47 v1(17.02,36.47)
RTC_CE: length 68.9
  Top Layer w0.254: v1(43.69,8.91) 43.81,9.03 U1.43 ; v1(22.48,51.33) U4.5
  Bottom Layer w0.254: v1(22.48,51.33) 22.48,10.68 24.37,8.78 43.56,8.78 v1(43.69,8.91)
RTC_CLK: length 69.6
  Top Layer w0.254: U4.7 v1(23.24,53.87) ; v1(43.18,9.67) 43.31,9.8 U1.42
  Bottom Layer w0.254: v1(23.24,53.87) 23.24,10.94 24.51,9.67 v1(43.18,9.67)
RTC_IO: length 68.5
  Top Layer w0.254: U4.6 20.55,52.73 v1(23.98,52.73) R9.1 ; v1(42.55,10.44) 42.8,10.69 42.8,13.03 U1.41
  Bottom Layer w0.254: v1(42.55,10.44) 24.77,10.44 23.88,11.32 23.88,52.6
SCL: length 47.2
  Top Layer w0.254: U12.3 68.45,5.21 R12.1 67.33,12.09 62.86,12.09 62.69,12.27 62.69,18.11 ; v1(44.92,20.14) 45.51,19.54 U1.11
  Bottom Layer w0.254: v1(62.61,18.18) 62.61,21.48 61.47,22.63 46.36,22.63 44.92,21.19 v1(44.92,20.14)
STEP: length 93
  Top Layer w0.254: U1.45 44.83,13.06 v1(44.83,14.88) ; U9.22 82.37,62.82 v1(82.55,62.63)
  Bottom Layer w0.254: v1(44.83,14.88) 47.88,14.88 48.51,14.25 48.51,12.97 49.4,12.09 81.41,12.09 82.42,13.1 82.42,62.51 v1(82.55,62.63)
SWITCH: length 41.8
  Top Layer w0.254: U16.2 10.3,26.44 R19.1 24.91,26.55 26.29,25.17 26.29,19.83 26.58,19.54 U1.26
TEMP_SDA: length 46.9
  Top Layer w0.254: v1(45.59,18.96) 45.68,19.04 U1.10 ; v1(61.98,16.78) 61.98,11.71 62.72,10.96 R11.1 65.66,9.55 65.4,9.29 64.01,9.29 63.75,9.04 63.75,7.95 63.93,7.77 65.41,7.77 65.66,7.51 65.66,4.97 63.81,3.13 U12.4
  Bottom Layer w0.254: v1(45.59,18.96) 45.59,21.1 46.61,22.12 60.96,22.12 61.98,21.1 v1(61.98,16.78)
TTL_RX: length 42.8
  Top Layer w0.254: U1.31 25.4,17.04 25.15,17.3 25.15,23.39 24.13,24.41 15.88,24.41 15.75,24.53 v1(15.62,24.53) ; U18.12 v1(15.75,33.93)
  Bottom Layer w0.254: v1(15.62,24.53) 15.62,33.8 v1(15.75,33.93)
TTL_TX: length 42.7
  Top Layer w0.254: v1(16.89,24.99) 16.97,24.91 17.53,24.91 17.75,25.14 17.75,25.65 18.03,25.93 19.05,25.93 19.28,25.7 19.28,25.07 19.43,24.91 20.57,24.91 20.8,25.14 20.8,25.75 20.98,25.93 22.15,25.93 22.33,25.75 22.33,25.09 22.5,24.91 24.38,24.91 25.58,23.72 25.58,17.8 25.83,17.54 28.09,17.54 28.27,17.72 28.27,18.08 28.5,18.31 29.61,18.31 29.79,18.13 29.79,17.72 29.97,17.54 U1.30 ; U18.11 v1(16.89,32.66)
  Bottom Layer w0.254: v1(16.89,24.99) v1(16.89,32.66)
U_SGADJ: length 44.5
  Top Layer w0.254: R2.1 50.67,58.19 51.12,58.64 ; v1(48.64,25.55) 46.48,25.55 45.81,24.88 U1.14
  Bottom Layer w0.254: v1(48.64,25.55) 48.64,56.16 51.12,58.64
USART2_RX: length 66.1
  Top Layer w0.254: v1(46.52,24.15) 46.31,23.94 U1.13
  Bottom Layer w0.254: U7.2 40.64,78.13 41.02,77.75 45.85,77.75 46.52,77.07 v1(46.52,24.15)
USART2_TX: length 66.1
  Top Layer w0.254: U1.12 v1(47.81,23.9)
  Bottom Layer w0.254: U7.1 43.08,82.25 43.08,79.37 43.46,78.99 46.51,78.99 47.87,77.62 47.87,23.96 v1(47.81,23.9)
USART3_RX: length 75.8
  Top Layer w0.254: U1.22 41.81,20.24 v1(41.53,19.96) ; v1(41.4,75.33) 41.4,76.51 42.12,77.24 55.37,77.24 56.14,78.01 FPC1.6
  Bottom Layer w0.254: 41.53,20.09 v1(41.53,19.96) ; v1(41.4,75.33) 41.53,75.21 41.53,20.09
USART3_TX: length 75.8
  Top Layer w0.254: v1(42.42,75.33) 42.48,75.4 42.48,75.52 42.42,75.59 42.42,75.97 42.93,76.48 56.01,76.48 57.27,77.74 57.27,80 FPC1.5 ; U1.21 42.31,20.19 v1(42.55,19.96)
  Bottom Layer w0.254: v1(42.42,75.33) 42.42,20.09 v1(42.55,19.96)
USBDM: length 28.9
  Top Layer w0.254: v1(30.73,13.74) 30.73,11.45 30.41,11.13 27.49,11.13 27.23,10.87 27.23,9.35 27.05,9.16 25.91,9.16 25.71,9.36 25.71,10.89 25.47,11.13 24.32,11.13 24.18,11 24.18,9.34 24,9.16 22.84,9.16 22.66,9.34 22.66,10.95 22.48,11.13 R18.2 ; v1(35.53,15.55) 35.53,15.57 36.5,16.54 U1.32
  Bottom Layer w0.254: v1(35.53,15.55) 32.54,15.55 v1(30.73,13.74)
USBDP: length 28.8
  Top Layer w0.254: R20.2 16.49,12.32 17.15,12.97 25.65,12.97 26.3,13.62 R21.1 v1(28.19,12.34) ; U1.33 36.98,16.04 v1(36.58,15.64)
  Bottom Layer w0.254: v1(28.19,12.34) 35.69,12.34 36.58,13.23 v1(36.58,15.64)
$1N1272: length 11.8
  Top Layer w0.254: U2.1 63.87,23.2 C8.2 61.52,23.41 R7.2 58.93,23.41 58.91,23.39 58.04,23.39 57.79,23.64 57.79,25.29 57.55,25.53 56.77,25.53 R6.2
$1N3398: length 10.8
  Top Layer w0.254: L1.2 82.02,37.89 D1.1 76.43,37.87 72.17,37.87
$1N5455: length 12.8
  Top Layer w0.254: X2.4 2.97,54.58 4.23,53.31 13.28,53.31 13.72,53.74 14.75,53.74 U4.2
$1N5465: length 12.8
  Top Layer w0.254: U4.3 13.6,52.6 13.3,52.9 4.12,52.9 2.97,51.75 X2.1
$1N7385: length 3.8
  Top Layer w0.254: v1(86.36,68.6) 86.27,68.69 U9.1
  Bottom Layer w0.254: v1(86.36,68.6) 88.66,68.6 C12.2
$1N7391: length 6.6
  Top Layer w0.254: U9.2 v1(85.62,66.57)
  Bottom Layer w0.254: v1(85.62,66.57) 88.63,66.57 C12.1
$1N7401: length 5.9
  Top Layer w0.254: R13.2 86.6,74.95 C15.1 86.6,72.32 84.97,70.69 U9.3
$1N7525: length 12.1
  Top Layer w0.254: v1(83.08,72.03) 83.02,71.96 U9.6
  Bottom Layer w0.254: R14.2 77.98,72.54 78.23,72.28 78.23,70.63 78.54,70.33 82.68,70.33 83.08,70.73 v1(83.08,72.03)
$1N7564: length 10.9
  Top Layer w0.254: U9.9 v1(81.07,71.65)
  Bottom Layer w0.254: R15.2 76.92,76.79 78.3,76.79 79.12,75.97 79.12,72.03 79.5,71.65 v1(81.07,71.65)
$1N7781: length 8.2
  Top Layer w0.254: U9.12 U9.13 78.47,71.92 77.98,72.41 R17.1 R16.2
$1N8903: length 6.3
  Top Layer w0.254: R18.1 19.39,7.57 19.39,3.83 U17.3
$1N8908: length 6.2
  Top Layer w0.254: U17.2 16.51,3.7 16.51,5.74 17.27,6.5 17.27,6.99 16.49,7.77 R20.1
$1N9681: length 6.4
  Top Layer w0.254: U18.15 20.19,37.74 20.69,38.23 C25.2
$1N9762: length 8.2
  Top Layer w0.254: C23.1 13.1,42.19 13.1,40.39 13.34,40.15 14.73,40.15 14.99,39.9 14.99,37.87 14.73,37.61 13.39,37.61 U18.2
$1N9803: length 4.3
  Top Layer w0.254: C24.2 9.67,40.77 11.43,39.01 U18.1
$1N9807: length 4.7
  Top Layer w0.254: U18.3 11.81,36.47 9.65,38.63 C24.1
$1N9881: length 4.1
  Top Layer w0.254: 9.65,36.33 10.78,35.2 U18.4
$1N9885: length 3.8
  Top Layer w0.254: 9.65,34.33 10.05,33.93 U18.5
$1N9891: length 3.6
  Top Layer w0.254: 12.57,32.53 12.55,32.54 11.43,31.56 10.1,31.56 9.84,31.82 9.72,31.82 9.53,31.63
$1N11608: length 3.2
  Top Layer w0.254: R8.1 71.88,23.82 71.88,26.28 LED1.1

## Copper pours and planes (outline as drawn; the poured copper is in the pictures)
3.3V on Top Layer: 61.72,54.62 64.9,54.62 64.9,31.77 61.72,31.77
3.3V on Top Layer: 56.52,52.6 58.42,52.6 58.42,51.84 56.52,51.84
3.3V on Top Layer: 14.25,57.81 15.62,57.81 15.62,55.29 14.25,55.29
3.3V on Top Layer: 28.83,3.7 33.42,3.7 33.42,2.43 28.83,2.43
3.3V on Top Layer: 33.04,11 72.01,11 72.01,0.4 33.04,0.4
3.3V on Top Layer: 60.97,40.79 70.61,40.79 70.61,21.36 60.97,21.36
3.3V on Top Layer: 29.79,2.43 34.04,2.43 34.04,1.14 29.79,1.14
3.3V on Top Layer: 34.67,22.73 40.89,22.73 40.89,20.85 34.67,20.85
3.3V on Top Layer: 9.83,15.77 11.56,15.77 11.56,15.01 9.83,15.01
12V on Top Layer: 73.02,32.41 86.49,32.41 86.49,28.68 73.02,28.68
12V on Top Layer: 85.6,23.14 88.77,23.14 88.77,15.26 85.6,15.26
12V on Top Layer: 85.73,78.25 89.66,78.25 89.66,24.66 85.73,24.66
GND on Top Layer: -0.76,86.76 90.68,86.76 90.68,-1 -0.76,-1
GND on Bottom Layer: -0.76,86.76 90.55,86.76 90.55,-0.74 -0.76,-0.74

Small or netless copper shapes (teardrops, artwork), in the pictures only: 455 on Top Layer, 123 on Bottom Layer
